# Altium schematic sheet Rail_discharge.SchDoc
size A4
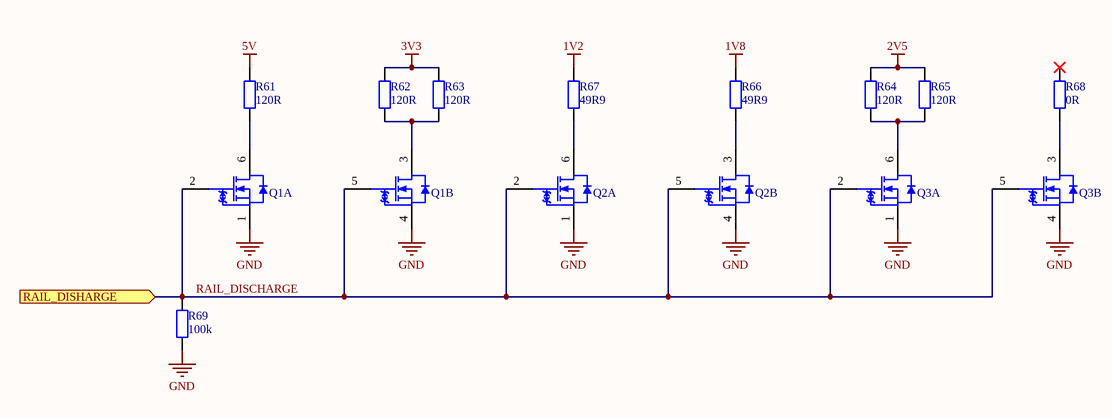
[diagram p0: Rail_discharge.SchDoc]

## Parts
Q1  SQ1922EEH-T1_GE3  [SOT236_M]  (value not drawn)  (parts A,B of 2)
Q2  SQ1922EEH-T1_GE3  [SOT236_M]  (value not drawn)  (parts A,B of 2)
Q3  SQ1922EEH-T1_GE3  [SOT236_M]  (value not drawn)  (parts A,B of 2)
R61  value 120R  [0603R_0.45_M]  (hidden comment: CRCW0603120RJNEB)
R62  value 120R  [0603R_0.45_M]  (hidden comment: CRCW0603120RJNEB)
R63  value 120R  [0603R_0.45_M]  (hidden comment: CRCW0603120RJNEB)
R64  value 120R  [0603R_0.45_M]  (hidden comment: CRCW0603120RJNEB)
R65  value 120R  [0603R_0.45_M]  (hidden comment: CRCW0603120RJNEB)
R66  value 49R9  [0402R_M]  (hidden comment: CRCW040249R9FKED)
R67  value 49R9  [0402R_M]  (hidden comment: CRCW040249R9FKED)
R68  value 0R  [0402R_M]  (hidden comment: Generic resitor)
R69  Resistance: 100k  [0402R_M]  (hidden comment: CRCW0402100KJNED)

## Ports
RAIL_DISHARGE (in)

## Nets
1V2: R67.2
1V8: R66.2
2V5: R64.2 R65.2
3V3: R62.2 R63.2
5V: R61.2
GND: Q1.1(S1) Q1.4(S2) Q2.1(S1) Q2.4(S2) Q3.1(S1) Q3.4(S2) R69.1
RAIL_DISCHARGE: Q1.2(G1) Q1.5(G2) Q2.2(G1) Q2.5(G2) Q3.2(G1) Q3.5(G2) R69.2 ; port RAIL_DISHARGE
NetQ1_3: Q1.3(D2) R62.1 R63.1
NetQ1_6: Q1.6(D1) R61.1
NetQ2_3: Q2.3(D2) R66.1
NetQ2_6: Q2.6(D1) R67.1
NetQ3_3: Q3.3(D2) R68.1
NetQ3_6: Q3.6(D1) R64.1 R65.1

Not connected (* = marked no-connect by the designer): R68 2*

## Library data of the parts
Q1-Q3 = SQ1922EEH-T1_GE3: DUAL N-CHANNEL 20-V (D-S) 175C M; Manufacturer: Vishay Siliconix; FET Type: 2 N-Channel (Dual); FET Feature: Standard; Drain to Source Voltage (Vdss): 20V; Current - Continuous Drain (Id) @ 25°C: 840mA (Tc); Vgs(th) (Max) @ Id: 1.5V @ 250µA; Gate Charge (Qg) (Max) @ Vgs: 1.2nC @ 4.5V; Input Capacitance (Ciss) (Max) @ Vds: 50pF @ 10V; Power - Max: 1.5W; Supplier 1: Digi-Key; Manufacturer Part Number: SQ1922EEH-T1_GE3; RoHS: RoHS Compliant; Category: Discrete Semiconductor Products; Stock 1: 0; Pricing 1: 1=0.48, 10=0.408, 25=0.3808, 100=0.3046, 250=0.2828, 500=0.23928, 1000=0.18491 (USD); Packaging: Cut Tape (CT); Part Status: Active; Operating Temperature: -55°C ~ 175°C (TJ); Mounting Type: Surface Mount; Package / Case: PowerPAK® SC-70-6 Dual; Supplier Device Package: PowerPAK® SC-70-6 Dual; ComponentLink1URL: http://www.vishay.com/docs/75204/sq1922eeh.pdf; ComponentLink1Description: http://www.vishay.com/docs/75204/sq1922eeh.pdf; Supplier Part Number 1: SQ1922EEH-T1_GE3CT-ND
R61-R65 = CRCW0603120RJNEB: RES 0603 120R 5% 100mW; Manufacturer: Vishay / Dale; Resistance: 120 Ohms; Temperature Coefficient: 200 PPM / K; Voltage Rating: 75 V; Qualification: Commercial; Supplier 1: Mouser; Supplier Part Number 1: 71-CRCW0603120RJNEB; Manufacturer Part Number: CRCW0603120RJNEB; RoHS: RoHS Compliant By Exemption; Category: Thick Film Resistors - SMD; Stock 1: 61795; Pricing 1: 1=0.091, 10=0.009, 100=0.007, 10000=0.003, 30000=0.002 (EUR); Height: 0.45 mm; Length: 1.55 mm; Operating Temperature Range: - 55 C to + 155 C; Package/Case: 0603 (1608 metric); Packaging: Reel; Power Rating: 100 mW; Product: Thick Film Resistors SMD; Series: CRCW; Termination Style: SMD/SMT; Tolerance: 5 %; Width: 0.85 mm; Brand: Vishay / Dale; Case Code - in: 0603; Case Code - mm: 1608; Standard Pack Qty: 10000; RoHS - Mouser: E; Minimum Order Quantity: 1; Reeling: True; ComponentLink1URL: http://www.mouser.com/ds/2/427/dcrcwe3-109170.pdf; ComponentLink1Description: http://www.mouser.com/ds/2/427/dcrcwe3-109170.pdf
R66 R67 = CRCW040249R9FKED: RES SMD 49.9 OHM 1% 1/16W 0402; Manufacturer: Vishay Dale; Power (Watts): 0.063W, 1/16W; Temperature Coefficient: ±100ppm/°C; Supplier 1: Digi-Key; Manufacturer Part Number: CRCW040249R9FKED; RoHS: RoHS Compliant; Category: Resistors; Stock 1: 0; Pricing 1: 1=0.1, 10=0.037, 100=0.0149, 1000=0.0067, 2500=0.00582, 5000=0.00481 (USD); Packaging: Cut Tape (CT); Part Status: Active; Tolerance: ±1%; Composition: Thick Film; Features: Automotive AEC-Q200; Operating Temperature: -55°C ~ 155°C; Package / Case: 0402 (1005 Metric); Supplier Device Package: 0402; Size / Dimension: 0.039" L x 0.020" W (1.00mm x 0.50mm); Height - Seated (Max): 0.016" (0.40mm); Failure Rate: -; ComponentLink1URL: http://www.vishay.com/docs/20035/dcrcwe3.pdf; ComponentLink1Description: http://www.vishay.com/docs/20035/dcrcwe3.pdf; Supplier Part Number 1: 541-49.9LCT-ND
R68 = Resistor
R69 = CRCW0402100KJNED: RES SMD 100K OHM 5% 1/16W 0402; Manufacturer: Vishay; Brand: Vishay / Dale; Power Rating: 63 mW; Temperature Coefficient: 200 PPM / K; Voltage Rating: 50 V; Unit Weight: 0.000023 oz; Supplier 1: Digi-Key; Manufacturer Part Number: CRCW0402100KJNED; Stock 1: 174; Pricing 1: 1=0.1, 10=0.025, 100=0.01, 1000=0.0045, 2500=0.0039, 5000=0.0032 (USD); Product Category: Thick Film Resistors - SMD; RoHS: Details; Tolerance: 5 %; Case Code - in: 0402; Case Code - mm: 1005; Operating Temperature Range: - 55 C to + 155 C; Series: CRCW; Height: 0.35 mm; Length: 1 mm; Package / Case: 0402 (1005 metric); Packaging: Reel; Product: Thick Film Resistors SMD; Factory Pack Quantity: 10000; Termination Style: SMD/SMT; Width: 0.5 mm; ComponentLink1URL: https://datasheet.ciiva.com/3255/dcrcwe3-3255949.pdf; ComponentLink1Description: https://datasheet.ciiva.com/3255/dcrcwe3-3255949.pdf; ComponentLink2URL: https://datasheet.ciiva.com/28420/dcrcwe3-28420124.pdf; ComponentLink2Description: https://datasheet.ciiva.com/28420/dcrcwe3-28420124.pdf; ComponentLink3URL: https://datasheet.ciiva.com/3255/dcrcwe3-3255950.pdf; ComponentLink3Description: https://datasheet.ciiva.com/3255/dcrcwe3-3255950.pdf; ComponentLink4URL: https://datasheet.ciiva.com/28621/1847332-28621326.pdf; ComponentLink4Description: https://datasheet.ciiva.com/28621/1847332-28621326.pdf; ComponentLink5URL: https://datasheet.ciiva.com/16763/70201119-16763038.pdf; ComponentLink5Description: https://datasheet.ciiva.com/16763/70201119-16763038.pdf; ComponentLink6URL: https://datasheet.ciiva.com/2461/dcrcwe3-2461990.pdf; ComponentLink6Description: https://datasheet.ciiva.com/2461/dcrcwe3-2461990.pdf; ComponentLink7URL: https://datasheet.ciiva.com/2461/dcrcwe3-2461989.pdf; ComponentLink7Description: https://datasheet.ciiva.com/2461/dcrcwe3-2461989.pdf; ComponentLink8URL: https://datasheet.ciiva.com/2461/dcrcwe3-2461991.pdf; ComponentLink8Description: https://datasheet.ciiva.com/2461/dcrcwe3-2461991.pdf; ComponentLink9URL: https://datasheet.ciiva.com/7777/1533075-7777191.pdf; ComponentLink9Description: https://datasheet.ciiva.com/7777/1533075-7777191.pdf; ComponentLink10URL: https://datasheet.ciiva.com/5552/dcrcwe3-109170-5552439.pdf; ComponentLink10Description: https://datasheet.ciiva.com/5552/dcrcwe3-109170-5552439.pdf; Supplier Part Number 1: 541-100KJDKR-ND